# Altium schematic sheet POWER.SchDoc
size A4; SheetNumber: 5; SheetTotal: 5
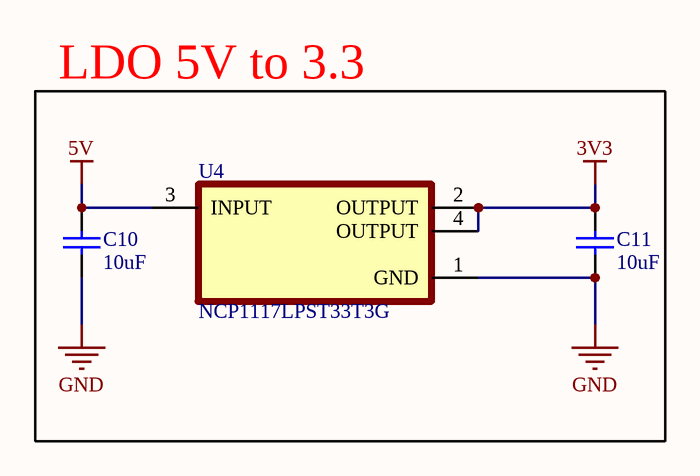
[diagram p0: POWER.SchDoc]

## Parts
C10  10uF  [CAP_0402L]
C11  10uF  [CAP_0402L]
U4  NCP1117LPST33T3G  [SOT230P700X175-4N]

## Blocks framed on the sheet
LDO 5V to 3.3: C10 C11 U4

## Nets
3V3: C11.2 U4.2(OUTPUT) U4.4(OUTPUT)
5V: C10.2 U4.3(INPUT)
GND: C10.1 C11.1 U4.1(GND)

## Library data of the parts
C10 C11 = CAP CER 10µF: CAP CER 10µF 16V X7R 10% 0402; Value: 100nF; Capacitor Type: Ceramic; Mount: Surface Mount; RoHS: Yes; Tolerance: 10%; Case/Package: 0402; Construction: Flat; Width: 0.02inch; Voltage Rating: 16V; Packaging: Tape and Reel; Series: C; Thickness: 0.022inch; Voltage Rating (DC): 16V; Capacitance: 100nF; Dielectric Material: Ceramic; Package Quantity: 50000; Height: 0.5mm; Dielectric: X7R; Depth: 0.5mm; Length: 1mm; Max Operating Temperature: 125°C; Min Operating Temperature: -55°C
U4 = NCP1117LPST33T3G: Linear Voltage Regulator IC Positive Fixed 1 Output 1A SOT-223; MF: ON Semiconductor; SnapEDA_Link: https://www.snapeda.com/parts/NCP1117LPST33T3G/Onsemi/view-part/?ref=snap; Package: SOT-223-4 ON Semiconductor; Value: *; MP: NCP1117LPST33T3G; Check_prices: https://www.snapeda.com/parts/NCP1117LPST33T3G/Onsemi/view-part/?ref=eda